# Altium schematic sheet BOTTOM_v40.SchDoc: AMF CONTROLLER GC12
size A4; DrawnBy: SURAJ; Engineer: SURAJ; SheetNumber: 8
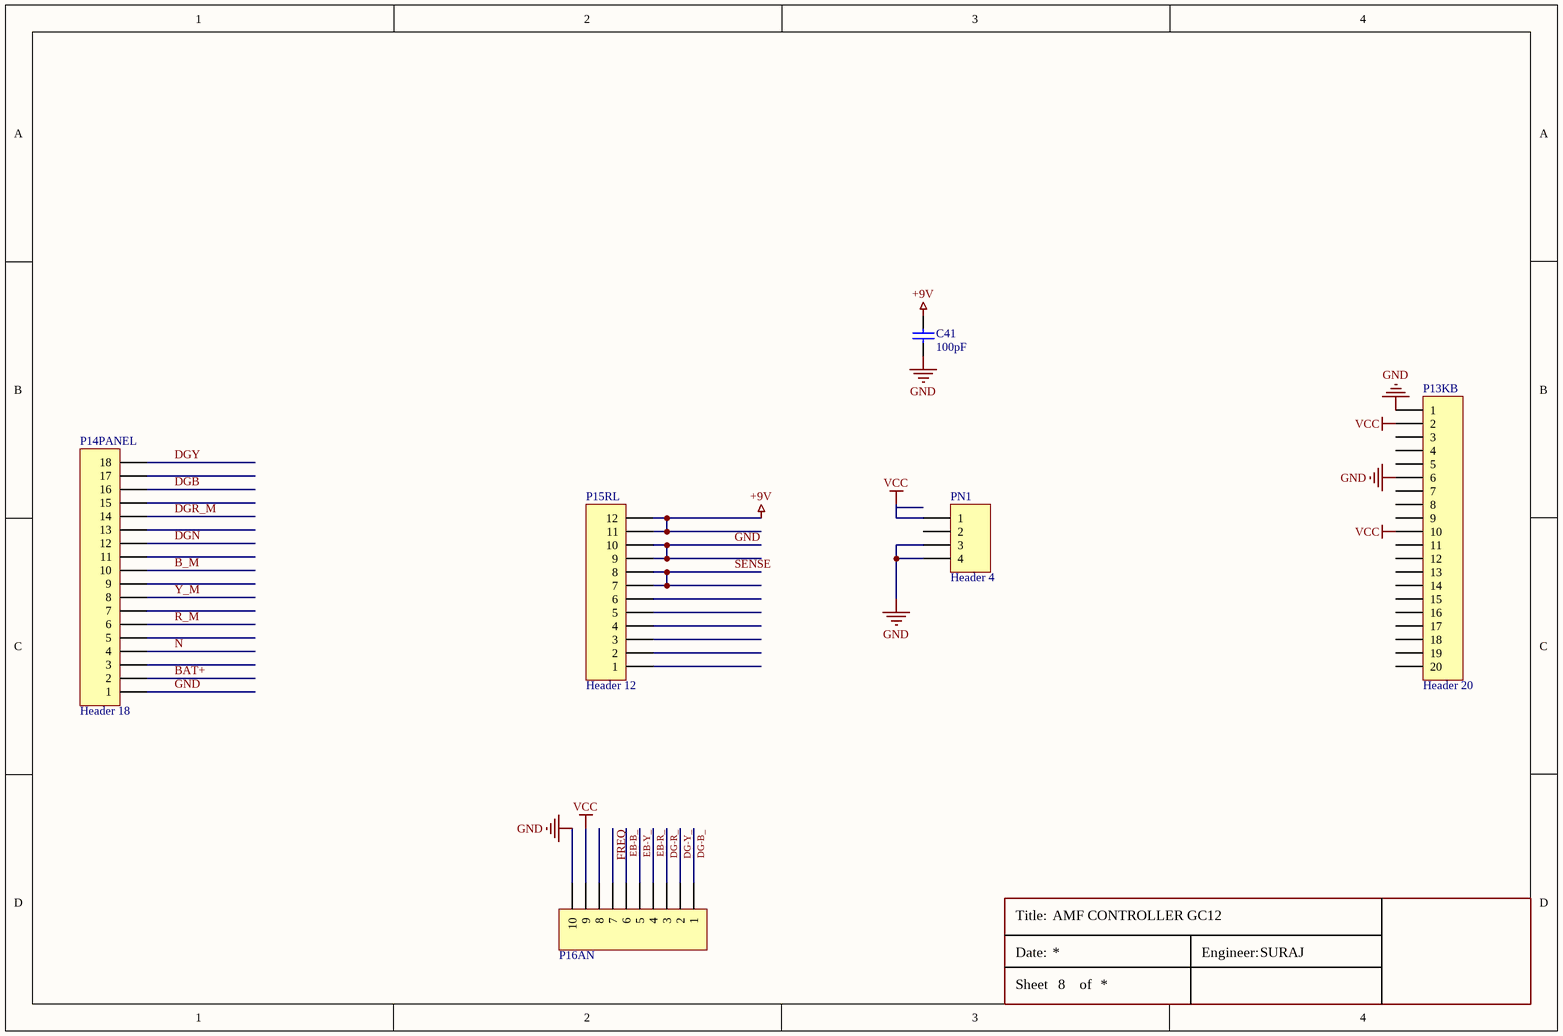
[diagram p0: BOTTOM_v40.SchDoc]

## Parts
C41  value 100pF  [C1206]  (hidden comment: .1uF 1206)
P13KB  Header 20  [HDR1X20_BURGE_F]
P14PANEL  Header 18  [HDR1X18_BURGE_F]
P15RL  Header 12  [HDR1X12_BURGE_F]
P16AN  Header 10  [HDR1X10_BURGE_F]  (value not drawn)
PN1  Header 4  [HDR1X4_BURGE_F]

## Nets
+9V: C41.2 P15RL.11 P15RL.12
GND: C41.1 P13KB.1 P13KB.6 P14PANEL.1 P15RL.9 P15RL.10 P16AN.10 PN1.3 PN1.4
VCC: P13KB.2 P13KB.10 P16AN.9 PN1.1
B_M: P14PANEL.10
BAT+: P14PANEL.2
DG-B_: P16AN.1
DG-R_: P16AN.3
DG-Y_: P16AN.2
DGB: P14PANEL.16
DGN: P14PANEL.12
DGR_M: P14PANEL.14
DGY: P14PANEL.18
EB-B_: P16AN.6
EB-R_: P16AN.4
EB-Y_: P16AN.5
FREQ: P16AN.7
N: P14PANEL.4
R_M: P14PANEL.6
SENSE: P15RL.7 P15RL.8
Y_M: P14PANEL.8

Not connected (* = marked no-connect by the designer): P13KB 3 4 5 7 8 9 11 12 13 14 15 16 17 18 19 20; P14PANEL 3 5 7 9 11 13 15 17; P15RL 1 2 3 4 5 6; P16AN 8; PN1 2

## Notes on the sheet
- Title:
- Date:
- Sheet
- of
- Engineer:

## Library data of the parts
C41 = Cap: Capacitor; Published: 8-Jun-2000; LatestRevisionDate: 17-Jul-2002; LatestRevisionNote: Re-released for DXP Platform.; PackageReference: RAD-0.3; Publisher: Altium Limited; PackageDescription: Radial Cap, Thru-Hole; 2 Leads; 0.3 in Pin Spacing
P13KB = Header 20: Header, 20-Pin; LatestRevisionDate: 17-Jul-2002; LatestRevisionNote: Re-released for DXP Platform.; Publisher: Altium Limited
P14PANEL = Header 18: Header, 18-Pin; LatestRevisionDate: 17-Jul-2002; LatestRevisionNote: Re-released for DXP Platform.; Publisher: Altium Limited
P15RL = Header 12: Header, 12-Pin; LatestRevisionDate: 17-Jul-2002; LatestRevisionNote: Re-released for DXP Platform.; Publisher: Altium Limited
P16AN = Header 10: Header, 10-Pin; LatestRevisionDate: 17-Jul-2002; LatestRevisionNote: Re-released for DXP Platform.; Publisher: Altium Limited
PN1 = Header 4: Header, 4-Pin; LatestRevisionDate: 17-Jul-2002; LatestRevisionNote: Re-released for DXP Platform.; Publisher: Altium Limited